# EAGLE design RobotDriver (EAGLE 7.7.0)
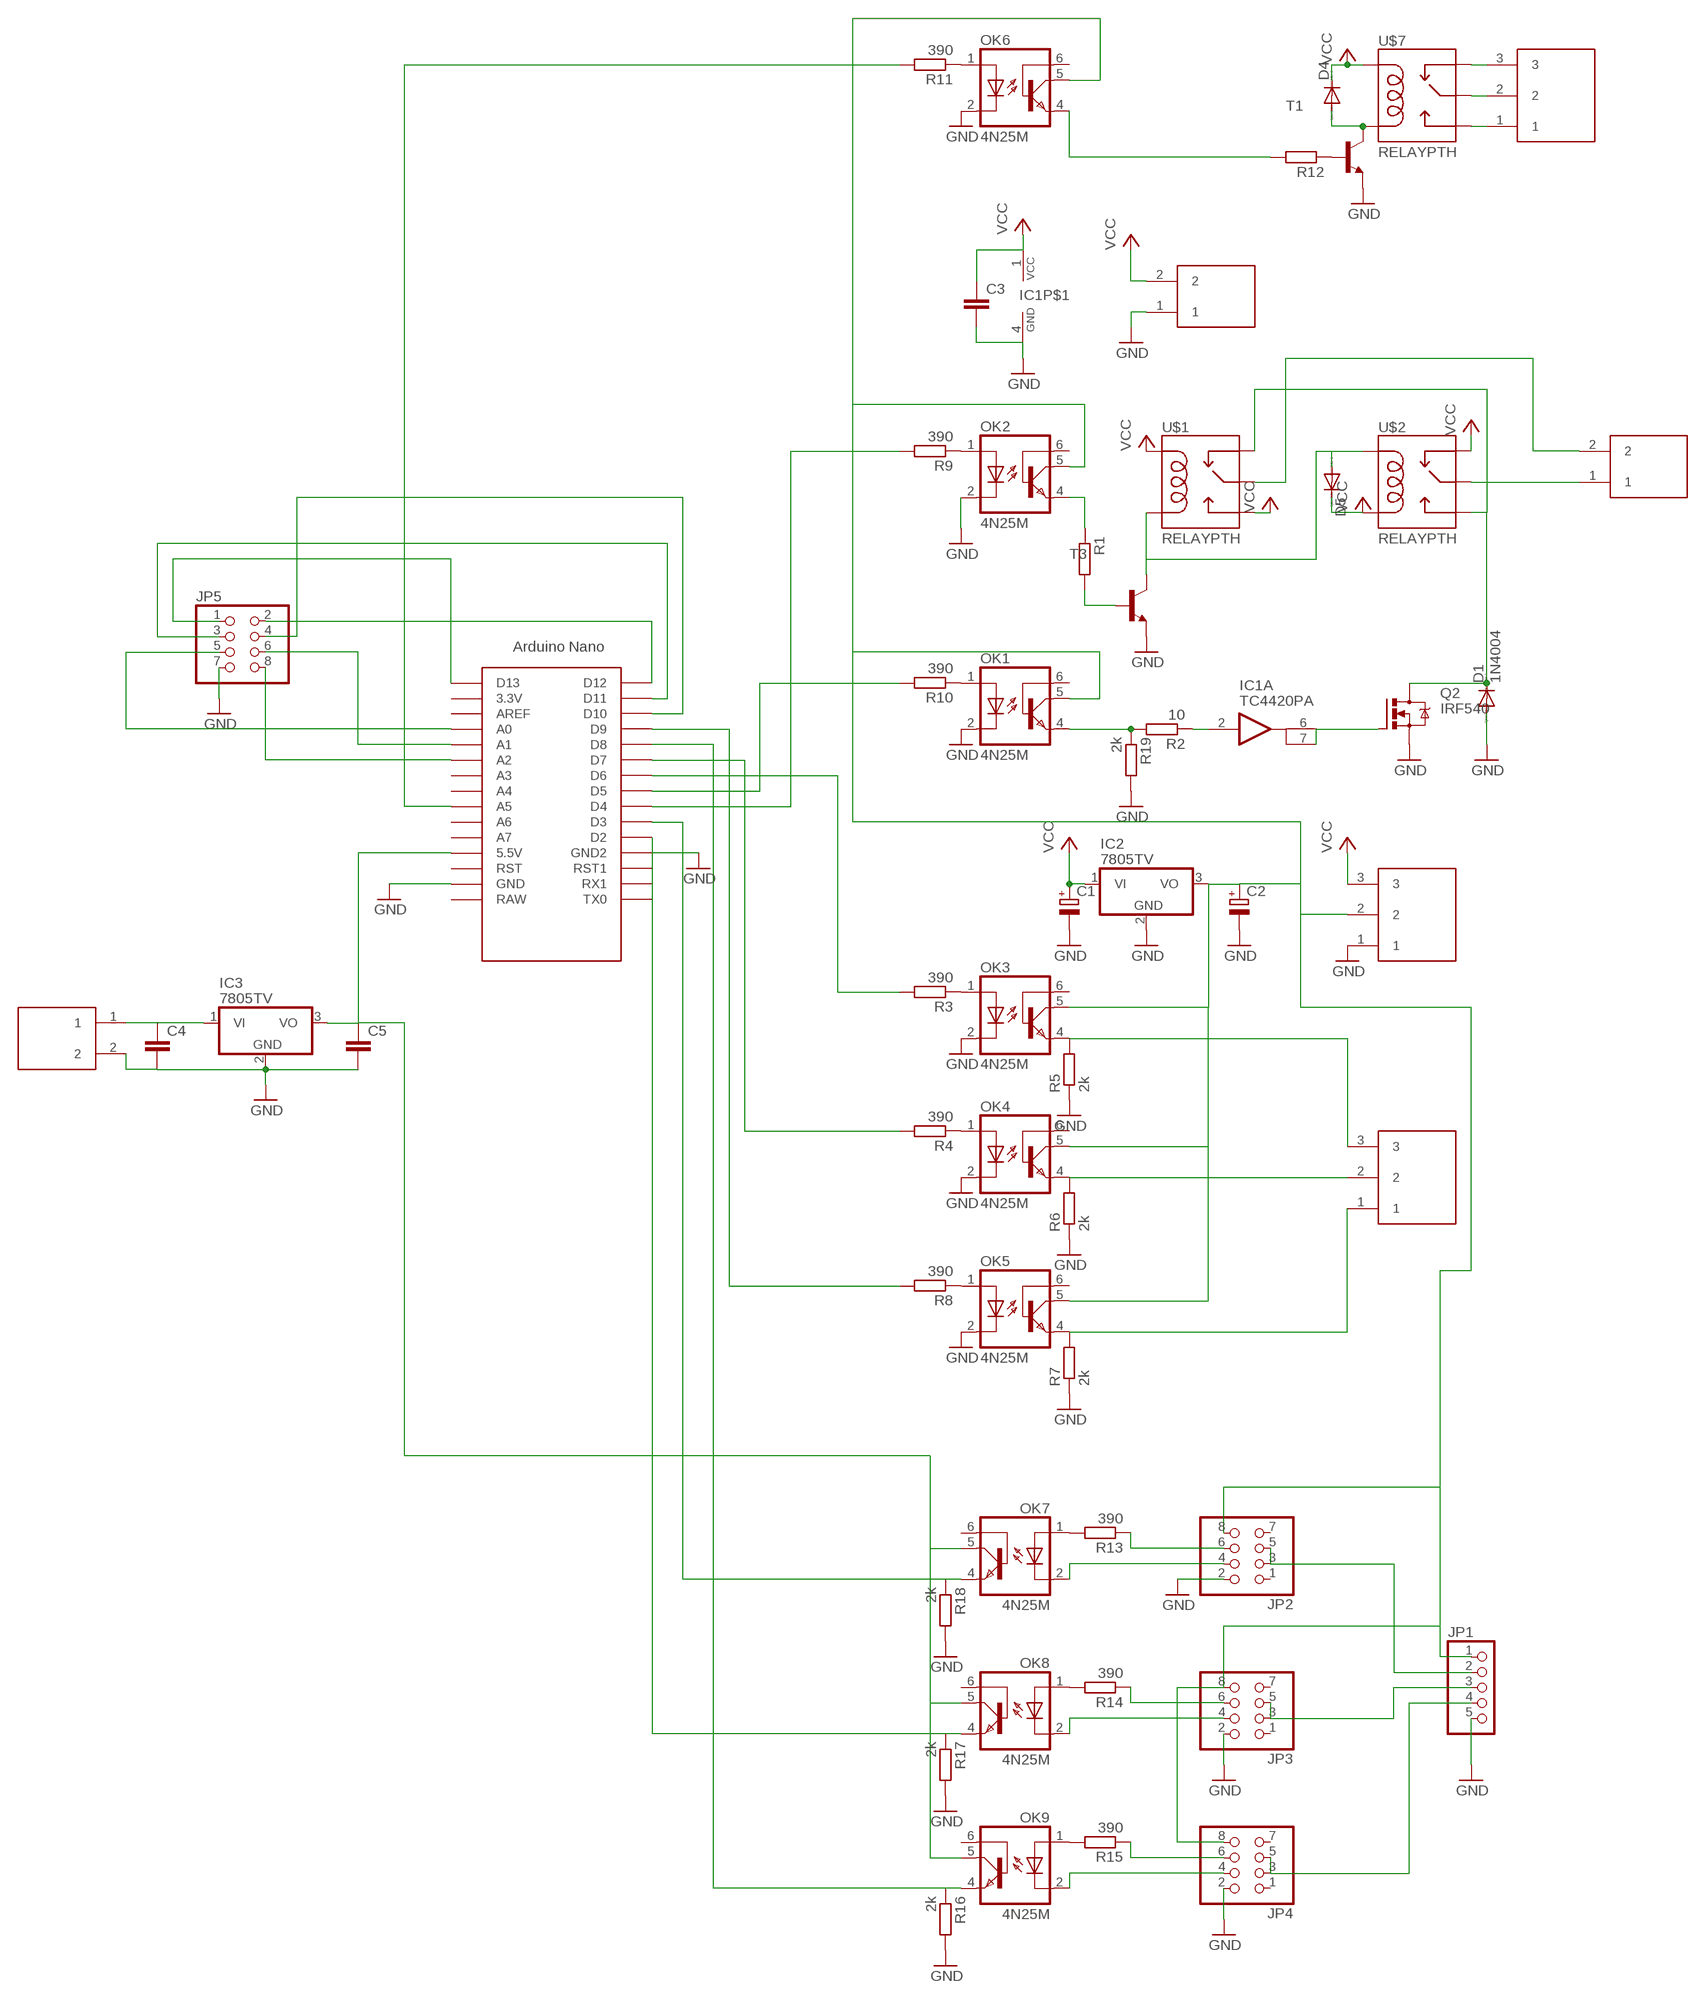
[diagram p0: schematic, sheet 1]

## Parts
C1  CPOL-EUE5-10.5  [E5-10,5]
C2  CPOL-EUE5-10.5  [E5-10,5]
C3  C-EUC1206  [C1206]
C4  C-EUC1206  [C1206]
C5  C-EUC1206  [C1206]
D1  1N4004  [DO41-10]
D4  DIODE-DO214AA  [DO214AA]
D5  DIODE-DO214AA  [DO214AA]
IC1  TC4420PA  [DIP08]
IC2  7805TV  [TO220V]
IC3  7805TV  [TO220V]
JP1  PINHD-1X5  [1X05]
JP2  PINHD-2X4  [2X04]
JP3  PINHD-2X4  [2X04]
JP4  PINHD-2X4  [2X04]
JP5  PINHD-2X4  [2X04]
OK1  4N25M  [DIL06]
OK2  4N25M  [DIL06]
OK3  4N25M  [DIL06]
OK4  4N25M  [DIL06]
OK5  4N25M  [DIL06]
OK6  4N25M  [DIL06]
OK7  4N25M  [DIL06]
OK8  4N25M  [DIL06]
OK9  4N25M  [DIL06]
Q2  IRF540  [TO220BV]
R1  R-EU_R1210  [R1210]
R2  10  R-EU_R1210  [R1210]
R3  390  R-EU_R1210  [R1210]
R4  390  R-EU_R1210  [R1210]
R5  2k  R-EU_R1210  [R1210]
R6  2k  R-EU_R1210  [R1210]
R7  2k  R-EU_R1210  [R1210]
R8  390  R-EU_R1210  [R1210]
R9  390  R-EU_R1210  [R1210]
R10  390  R-EU_R1210  [R1210]
R11  390  R-EU_R1210  [R1210]
R12  R-EU_R1210  [R1210]
R13  390  R-EU_R1210  [R1210]
R14  390  R-EU_R1210  [R1210]
R15  390  R-EU_R1210  [R1210]
R16  2k  R-EU_R1210  [R1210]
R17  2k  R-EU_R1210  [R1210]
R18  2k  R-EU_R1210  [R1210]
R19  2k  R-EU_R1210  [R1210]
T1  BC817-16-NPN-SOT23-BEC  [SOT23-BEC]
T3  BC817-16-NPN-SOT23-BEC  [SOT23-BEC]
U$1  RELAYPTH  [SRD-05VDC-SL-C]
U$2  RELAYPTH  [SRD-05VDC-SL-C]
U$3  NANO  [NANO]
U$4  2EDG-2  [2EGD-2-PAK]
U$5  2EDG-2  [2EGD-2-PAK]
U$6  2EDG-3  [2EGD-3-PAK]
U$7  RELAYPTH  [SRD-05VDC-SL-C]
U$8  2EDG-3  [2EGD-3-PAK]
U$9  2EDG-3  [2EGD-3-PAK]
U$10  2EDG-2  [2EGD-2-PAK]

## Nets
GND: C1.- C2.- C3.2 C4.2 C5.2 D1.A IC1.4(P$1:GND) IC2.2(GND) IC3.2(GND) JP1.5 JP2.2 JP3.2 JP4.2 JP5.7 OK1.2(C) OK2.2(C) OK3.2(C) OK4.2(C) OK5.2(C) OK6.2(C) Q2.S R5.1 R6.1 R7.1 R16.2 R17.2 R18.2 R19.2 T1.E T3.E U$3.GND U$3.GND1(GND2) U$5.1 U$9.1 U$10.2
N$1: R1.2 T3.B
N$2: D5.A T3.C U$1.COIL0 U$2.COIL1
N$3: OK2.4(EMI) R1.1
N$4: D1.C Q2.D U$1.SWCLOSED(SWCLOSE) U$2.SWOPEN
N$5: OK1.4(EMI) R2.2 R19.1
N$6: OK3.1(A) R3.1
N$7: OK2.1(A) R9.1
N$8: OK1.1(A) R10.1
N$9: R9.2 U$3.D4
N$10: U$2.SWCOMMON U$4.1
N$11: U$1.SWCOMMON U$4.2
N$12: IC1.6(A:OUT1) IC1.7(A:OUT2) Q2.G
N$13: C2.+ IC2.3(VO) JP1.1 JP2.8 JP3.8 JP4.8 OK1.5(COL) OK2.5(COL) OK3.5(COL) OK4.5(COL) OK5.5(COL) OK6.5(COL) U$9.2
N$14: OK3.4(EMI) R5.2 U$6.3
N$15: OK4.4(EMI) R6.2 U$6.2
N$16: OK5.4(EMI) R7.2 U$6.1
N$17: OK4.1(A) R4.1
N$18: OK5.1(A) R8.1
N$19: OK6.1(A) R11.1
N$20: D4.A T1.C U$7.COIL0
N$21: R12.1 T1.B
N$22: JP2.4 OK7.2(C)
N$23: OK6.4(EMI) R12.2
N$24: JP3.6 R14.1
N$25: OK7.1(A) R13.2
N$26: OK8.1(A) R14.2
N$27: OK9.1(A) R15.2
N$28: JP3.4 OK8.2(C)
N$29: JP2.6 R13.1
N$30: JP4.6 R15.1
N$31: JP4.4 OK9.2(C)
N$32: IC1.2(A:IN) R2.1
N$33: C5.1 IC3.3(VO) OK7.5(COL) OK8.5(COL) OK9.5(COL) U$3.5V(5.5V)
N$34: JP5.2 U$3.D12
N$35: JP1.2 JP2.3 JP2.5
N$36: JP1.3 JP3.3 JP3.5
N$37: JP1.4 JP4.3 JP4.5
N$38: OK9.4(EMI) R16.1 U$3.D8
N$39: OK8.4(EMI) R17.1 U$3.D2
N$40: OK7.4(EMI) R18.1 U$3.D3
N$41: U$7.SWCLOSED(SWCLOSE) U$8.3
N$42: U$7.SWCOMMON U$8.2
N$43: U$7.SWOPEN U$8.1
N$44: C4.1 IC3.1(VI) U$10.1
N$45: R11.2 U$3.A5
N$46: JP5.1 U$3.D13
N$47: R10.2 U$3.D5
N$48: R3.2 U$3.D6
N$49: R4.2 U$3.D7
N$50: R8.2 U$3.D9
N$51: JP5.3 U$3.D11
N$52: JP5.4 U$3.D10
N$53: JP5.5 U$3.A0
N$54: JP5.6 U$3.A1
N$55: JP5.8 U$3.A2
VCC: C1.+ C3.1 D4.C D5.C IC1.1(P$1:VCC) IC2.1(VI) U$1.COIL1 U$1.SWOPEN U$2.COIL0 U$2.SWCLOSED(SWCLOSE) U$5.2 U$7.COIL1 U$9.3
Unconnected: JP2.1 JP2.7 JP3.1 JP3.7 JP4.1 JP4.7 OK1.6(BAS) OK2.6(BAS) OK3.6(BAS) OK4.6(BAS) OK5.6(BAS) OK6.6(BAS) OK7.6(BAS) OK8.6(BAS) OK9.6(BAS) U$3.3.3V U$3.A3 U$3.A4 U$3.A6 U$3.A7 U$3.AREF U$3.ICSP1 U$3.ICSP2 U$3.ICSP3 U$3.ICSP4 U$3.ICSP5 U$3.ICSP6 U$3.RAW U$3.RST U$3.RST1 U$3.RX1 U$3.TX0

## Power pins joined to a net without a drawn wire
GND: IC1.5(P$2:GND)
VCC: IC1.8(P$2:VCC)

## Library data of the parts
C1 C2 = rcl:CPOL-EU: POLARIZED CAPACITOR, European symbol
C3-C5 = rcl:C-EU: CAPACITOR, European symbol
D1 = diode:1N4004: DIODE general purpose rectifier, 1 A
D4 D5 = diode:DIODE-: DIODE
IC1 = newchips:TC4420: Microchip 6A High-Speed MOSFET Drivers
IC2 IC3 = linear:78*: Positive VOLTAGE REGULATOR Source: http://cache.national.com/ds/LM/LM78L05.pdf http://www.fairchildsemi.com/ds/LM/LM7805.pdf
JP1 = pinhead:PINHD-1X5: PIN HEADER
JP2-JP5 = pinhead:PINHD-2X4: PIN HEADER
OK1-OK9 = optocoupler:4N*?M: General Purpose 6-Pin Phototransistor Optocouplers Source: http://www.fairchildsemi.com/ds/4N/4N35-M.pdf; MPN: 4N25-M; OC_FARNELL: 1021349; OC_NEWARK: 98K9084
Q2 = transistor-power:IRF540: HEXFET Power MOSFET
R1-R19 = rcl:R-EU_: RESISTOR, European symbol
T1 T3 = transistor:*-NPN-: NPN Transistror BF959 corrected 2008.03.06
U$1 U$2 U$7 = SRD-05VDC-SL-C:RELAY: SPDT relay (COM-00101)
U$3 = Arduino-clone:NANO: Arduino Nano
U$4 U$5 U$10 = tommilib:2EDG-2
U$6 U$8 U$9 = tommilib:2EDG-3

## Board
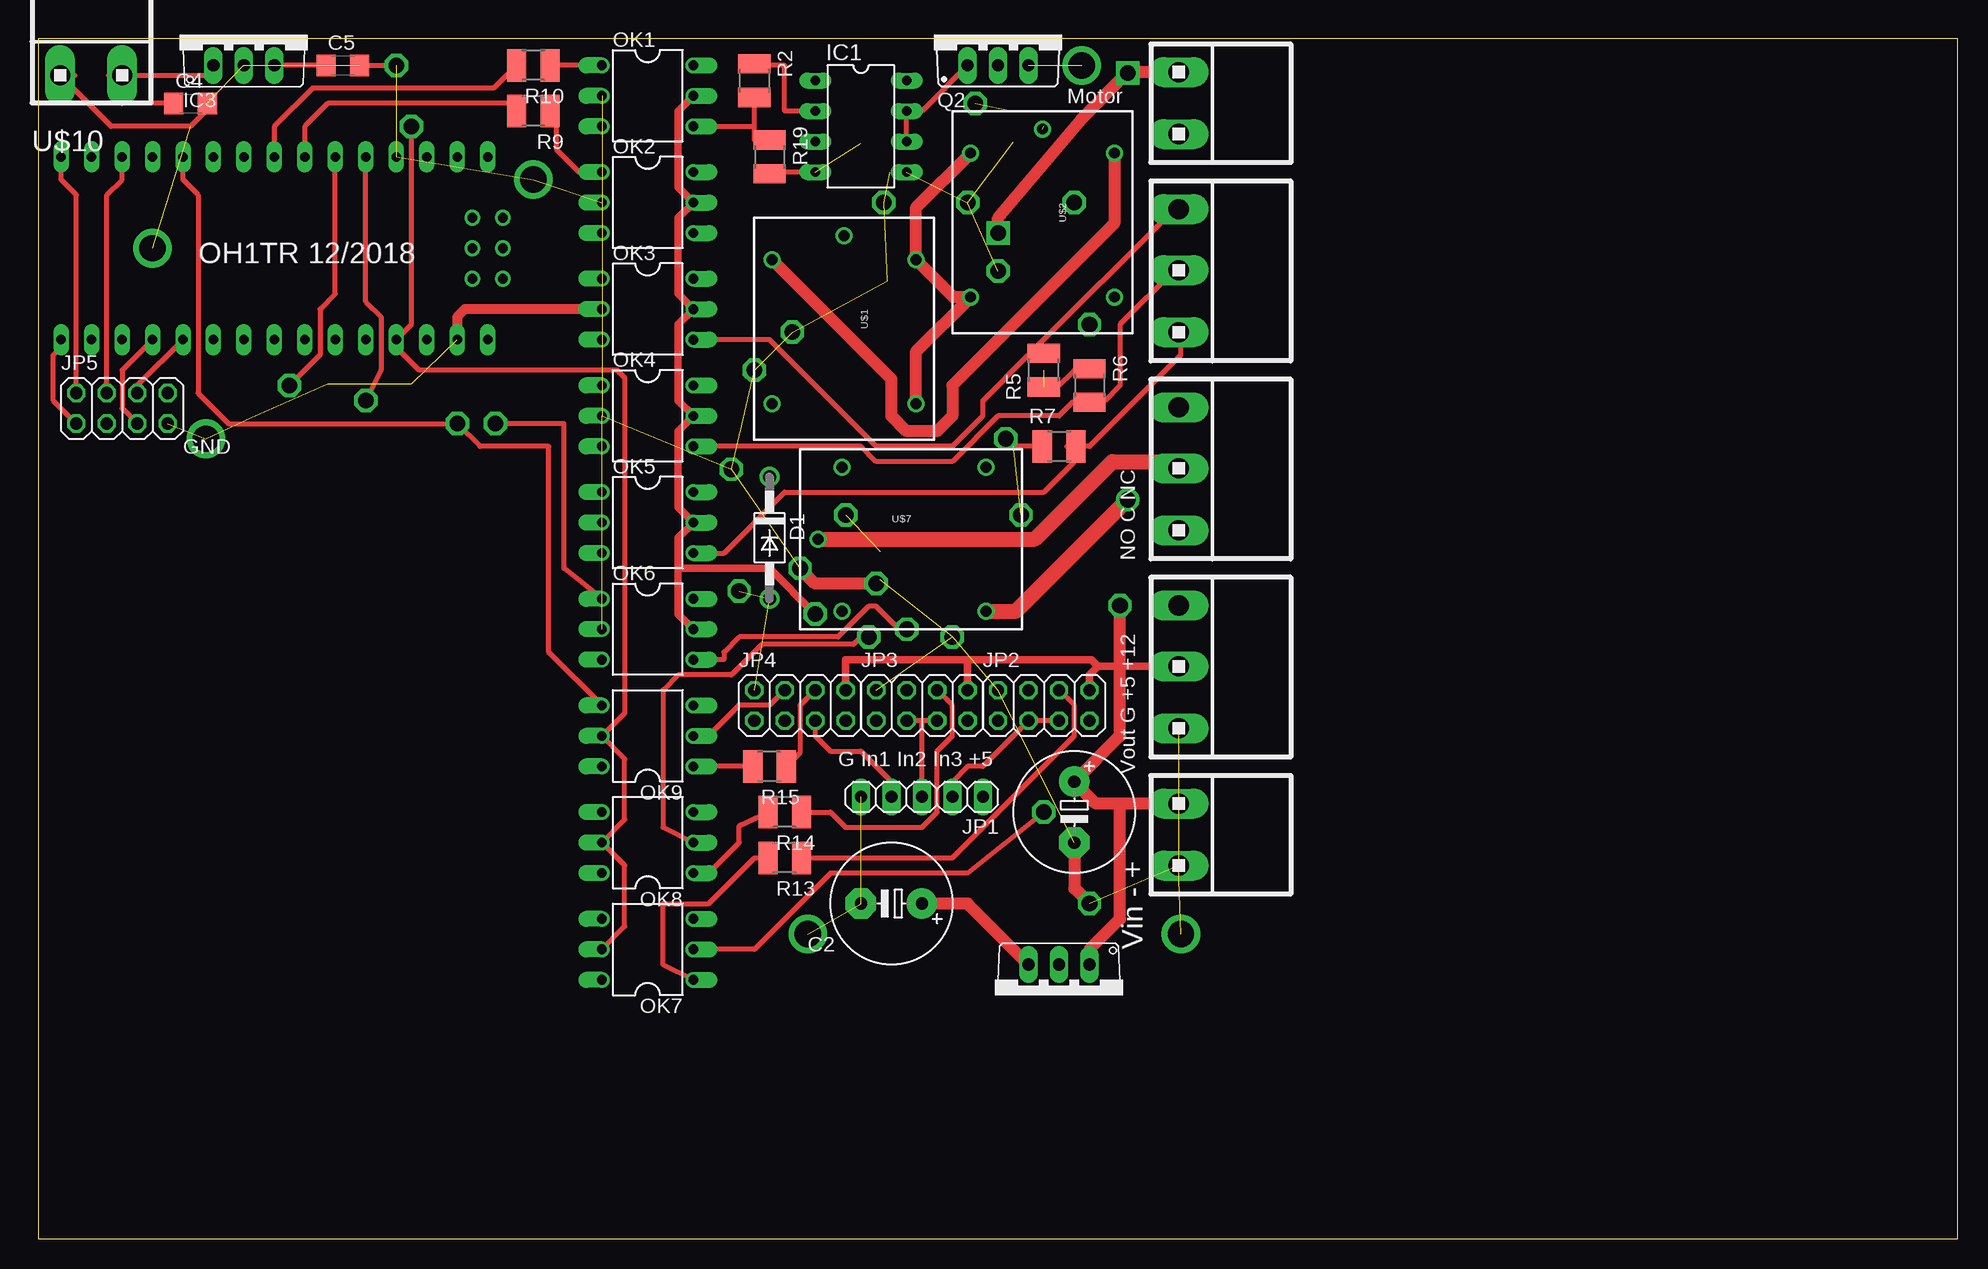
[diagram p1: board, top side]
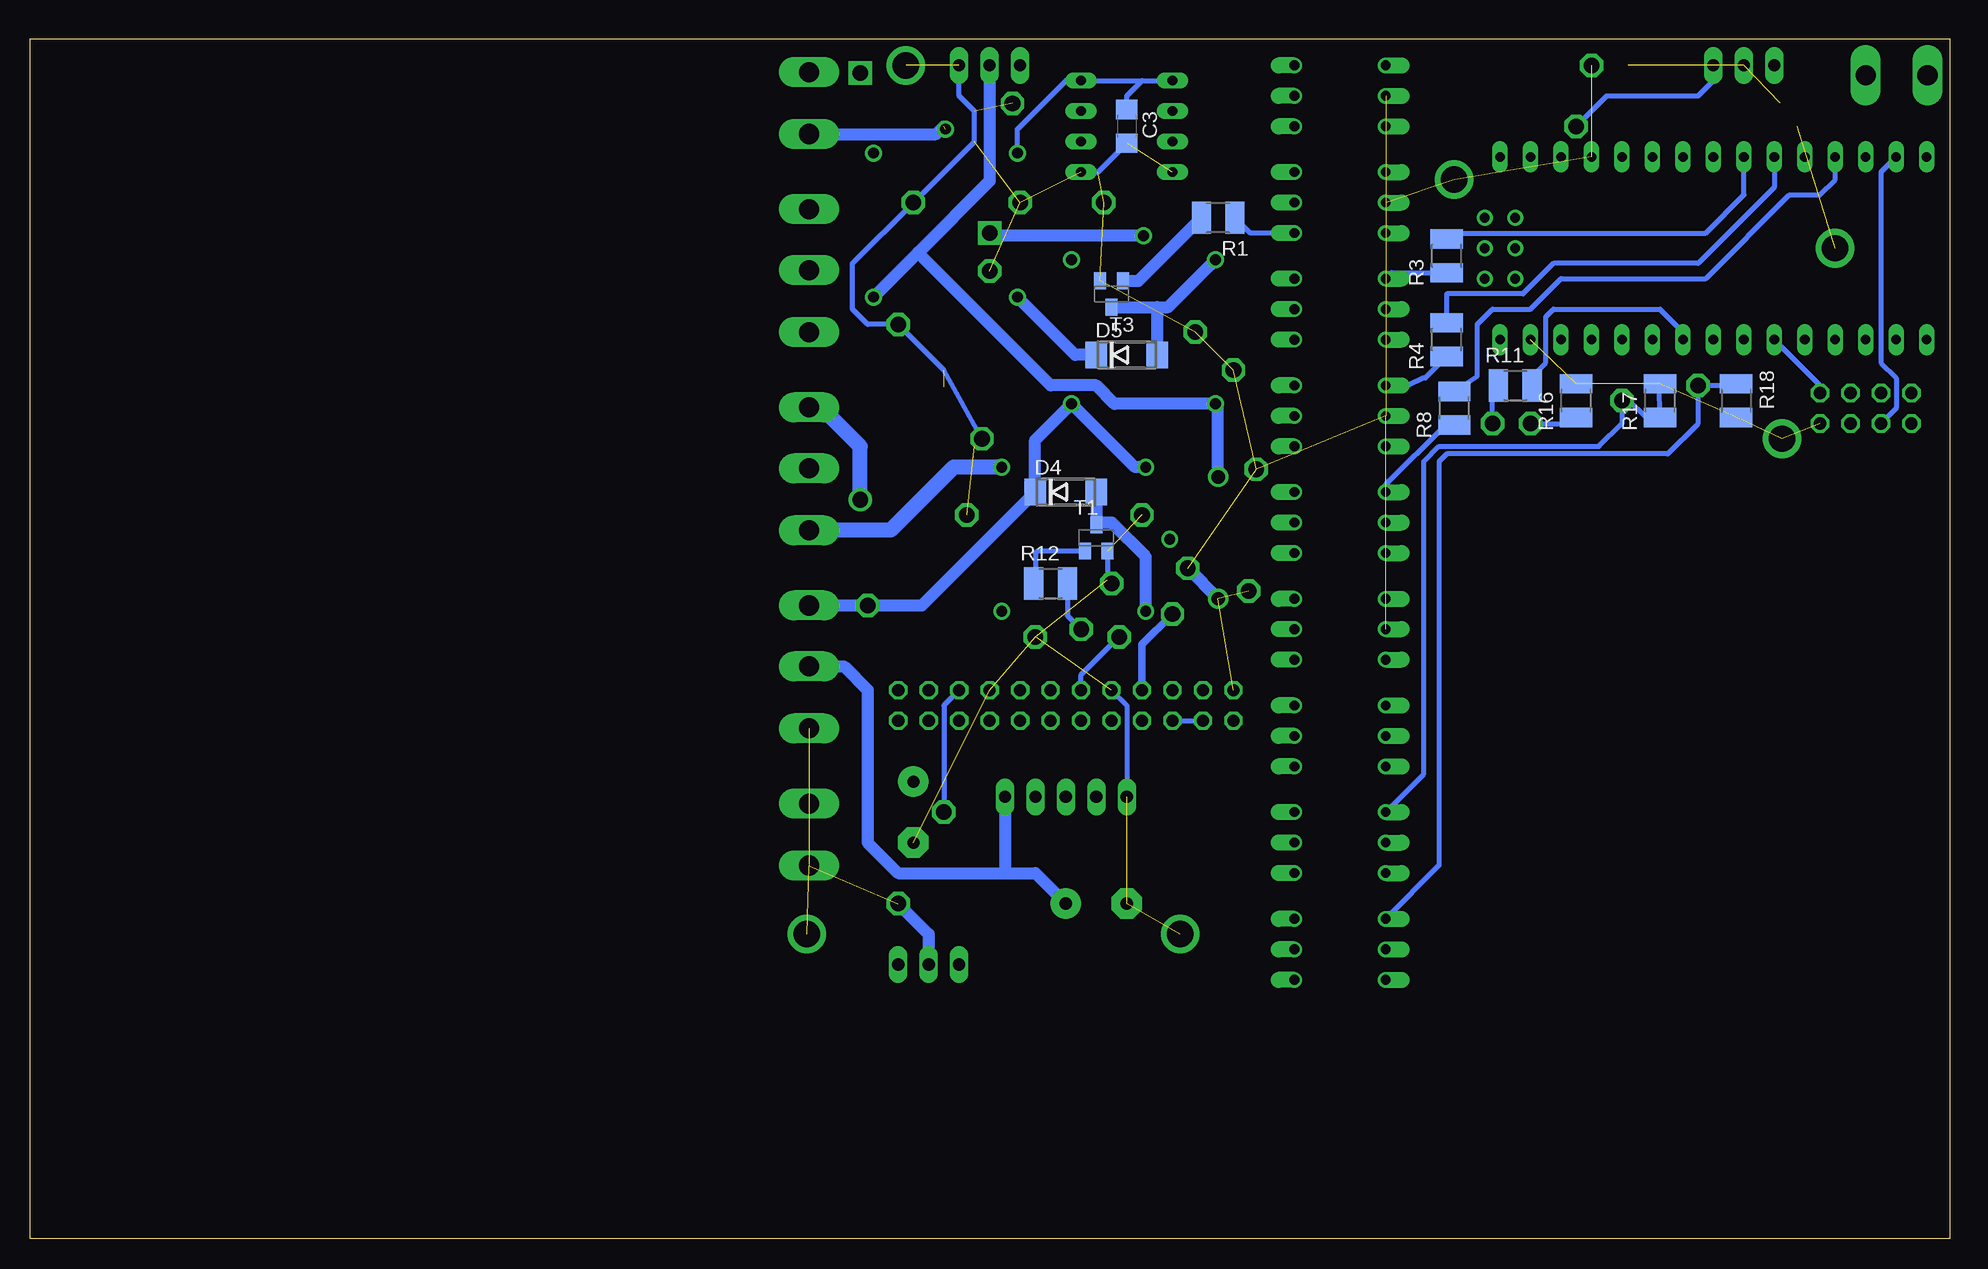
[diagram p2: board, bottom side, seen from below]

Size 160 x 100 mm. Coordinates in mm from the lower left corner, seen from the top.
Outline: 0,0 160,0 160,100 0,100 0,0
Copper layers (1*16): Top 0.035mm / dielectric 1.5mm / Bottom 0.035mm
Design rules "ITEADstudio_DRC": minimum track width 6mil, minimum drill 12mil, track to track 6mil, track to pad 6mil, pad to pad 6mil, via to via 6mil, smd to smd 0mil, copper to edge 10mil, drill to drill 10mil, minimum pad ring 10mil, minimum via ring 6mil, stop-mask expansion 2mil, vias tented up to drill 100mil, thermal gap 10mil

### Footprints (pad centres in the part's own frame; a part is rotated, then mirrored left to right if it is on the bottom)
E5-10,5 = drill 1.016 pad 2.54: + -2.54,0 | drill 1.016 pad 2.54 octagon: - 2.54,0
C1206 = smd 1.6 x 1.8: 1 -1.4,0; 2 1.4,0
DO41-10 = drill 1.118: A 5.08,0; C -5.08,0
DO214AA = smd 1.8 x 2.2: A 2.55,0; C -2.55,0
DIP08 = drill 0.813 long: 1 -3.81,-3.81; 2 -1.27,-3.81; 3 1.27,-3.81; 4 3.81,-3.81; 5 3.81,3.81; 6 1.27,3.81; 7 -1.27,3.81; 8 -3.81,3.81
TO220V = drill 1.016 long: 1 -2.54,-2.54; 2 0,-2.54; 3 2.54,-2.54
1X05 = drill 1.016 long: 1 -5.08,0; 2 -2.54,0; 3 0,0; 4 2.54,0; 5 5.08,0
2X04 = drill 1.016 octagon: 1 -3.81,-1.27; 2 -3.81,1.27; 3 -1.27,-1.27; 4 -1.27,1.27; 5 1.27,-1.27; 6 1.27,1.27; 7 3.81,-1.27; 8 3.81,1.27
DIL06 = drill 0.813 offset: 1 -2.54,-3.81; 2 0,-3.81; 3 2.54,-3.81; 4 2.54,3.81; 5 0,3.81; 6 -2.54,3.81
TO220BV = drill 1.016 long: D 0,-2.54; G -2.54,-2.54; S 2.54,-2.54
R1210 = smd 1.6 x 2.7: 1 -1.4,0; 2 1.4,0
SOT23-BEC = smd 1 x 1.4: B -0.95,-1.1; C 0,1.1; E 0.95,-1.1
SRD-05VDC-SL-C = drill 0.9: COIL0 -5.39,-6.12; COIL1 -5.39,5.88; SWCLOSED 6.61,-6.12; SWCOMMON -7.39,-0.12; SWOPEN 6.61,5.88
NANO = drill 0.8 long: 3.3V -10.16,24.13; 5V -10.16,-1.27; A0 -10.16,19.05; A1 -10.16,16.51; A2 -10.16,13.97; A3 -10.16,11.43; A4 -10.16,8.89; A5 -10.16,6.35; A6 -10.16,3.81; A7 -10.16,1.27; AREF -10.16,21.59; D2 5.08,1.27; D3 5.08,3.81; D4 5.08,6.35; D5 5.08,8.89; D6 5.08,11.43; D7 5.08,13.97; D8 5.08,16.51; D9 5.08,19.05; D10 5.08,21.59; D11 5.08,24.13; D12 5.08,26.67; D13 -10.16,26.67; GND -10.16,-6.35; GND1 5.08,-1.27; RAW -10.16,-8.89; RST -10.16,-3.81; RST1 5.08,-3.81; RX1 5.08,-6.35; TX0 5.08,-8.89 | drill 0.8: ICSP1 -5.08,-10.16; ICSP2 -5.08,-7.62; ICSP3 -2.54,-10.16; ICSP4 -2.54,-7.62; ICSP5 0,-10.16; ICSP6 0,-7.62
2EGD-2-PAK = drill 1.676 long: 1 3.181,-4; 2 -1.981,-4
2EGD-3-PAK = drill 1.676 long: 1 5.721,-5.27; 2 0.559,-5.27; 3 -4.521,-5.27

### Placement (x,y rotation side)
C1  86.36,35.56 270 top
C2  71.12,27.94 180 top
C3  68.58,92.71 270 bottom
C4  12.7,94.61 0 top
C5  25.4,97.79 0 top
D1  60.96,58.42 270 top
D4  73.66,62.23 0 bottom
D5  68.58,73.66 0 bottom
IC1  68.58,92.71 270 top
IC2  85.09,20.32 180 top
IC3  17.14,100.33 0 top
JP1  73.66,36.83 180 top
JP2  83.82,44.45 0 top
JP3  73.66,44.45 0 top
JP4  63.5,44.45 0 top
JP5  6.99,69.22 0 top
OK1  50.8,95.25 270 top
OK2  50.8,86.36 270 top
OK3  50.8,77.47 270 top
OK4  50.8,68.58 270 top
OK5  50.8,59.69 270 top
OK6  50.8,50.8 270 top
OK7  50.8,24.13 90 top
OK8  50.8,33.02 90 top
OK9  50.8,41.91 90 top
Q2  80.01,100.33 0 top
R1  60.96,85.09 180 bottom
R2  59.69,96.52 270 top
R3  41.91,81.92 90 bottom
R4  41.91,74.93 90 bottom
R5  83.82,72.39 90 top
R6  87.63,71.12 270 top
R7  85.09,66.04 0 top
R8  41.27,69.22 90 bottom
R9  41.27,93.98 180 top
R10  41.27,97.79 180 top
R11  36.2,71.12 0 bottom
R12  74.93,54.61 0 bottom
R13  62.23,31.75 180 top
R14  62.23,35.56 180 top
R15  60.96,39.37 180 top
R16  31.11,69.85 90 bottom
R17  24.13,69.85 90 bottom
R18  17.78,69.85 270 bottom
R19  60.96,90.17 270 top
T1  71.12,58.42 0 bottom
T3  69.85,78.74 180 bottom
U$1  67.3,76.2 270 top
U$2  83.82,85.09 270 top
U$3  28.57,85.09 90 top
U$4  99.06,95.25 270 top
U$5  99.06,34.29 270 top
U$6  100.33,81.28 270 top
U$7  72.39,58.42 0 top
U$8  100.33,64.77 270 top
U$9  100.33,48.26 270 top
U$10  3.81,100.97 0 top

### Tracks (layer width: path | path; a pad name or v marks a point on that pad's centre or on a via)
GND  (via drill 1.3, 2.2)  (43 unrouted)
  Top 0.406: R5.1 84.96,70.99 86.36,72.39 87.5,72.39 R6.1 | IC1.4 61.09,88.9 R19.2 | 3.04,96.97 U$10.2 6.08,92.71 12.7,92.71 14.1,94.11 C4.2 | C5.2 v29.84,97.79 | R7.1 81.28,66.04 v80.64,66.67
  Top 0.813: OK3.2 35.56,77.47 34.92,76.83 U$3.GND
  Top 1.016: v69.85,54.61 64.77,54.61 v63.5,55.88 | C1.- 86.36,29.21 v87.63,27.94
  Bottom 0.406: IC1.5 70.99,88.9 C3.2 | Q2.S 82.55,95.25 81.28,93.98 81.28,91.44 v86.36,86.36 91.44,81.28 91.44,77.47 90.17,76.2 v87.63,76.2 83.82,72.39 v80.64,66.67 | T1.E 70.17,54.93 v69.85,54.61 | JP3.2 68.58,44.45 JP1.5
  Bottom 1.016: v63.5,55.88 D1.A | v87.63,27.94 85.09,25.4 IC2.2
  other vias: 62.87,75.56 59.69,72.39 57.78,64.14 58.42,53.98 77.47,86.36 70.48,86.36 76.2,50.16 80.01,80.64 78.11,94.61 67.31,60.33 81.92,60.33 95.25,25.4 87,97.79 64.14,25.4 41.27,88.27 9.53,82.55 13.97,66.67
N$1
  Bottom 1.016: T3.B 67.61,79.84 R1.2
N$2
  Top 1.016: U$2.COIL1 89.7,84.62 76.2,71.12 76.2,68.58 74.93,67.31 72.39,67.31 71.12,68.58 71.12,71.65 U$1.COIL0
  Bottom 1.016: 61.66,81.11 U$1.COIL0 65.13,77.64 66.04,77.64 | T3.C 66.04,77.64 | D5.A 66.03,77.63 66.04,77.64
N$3
  Bottom 0.406: OK2.4 58.29,83.82 R1.1
N$4
  Bottom 1.016: Q2.D 80.01,88.17 86,82.19 | 86,82.19 U$2.SWOPEN | 86,82.19 74.93,71.12 71.12,71.12 69.59,69.59 U$1.SWCLOSED 60.96,69.59 D1.C
N$5
  Top 0.406: R19.1 59.69,91.57 59.69,92.71 | 59.69,92.71 R2.2 | OK1.4 59.69,92.71
N$6
  Bottom 0.406: OK3.1 46.48,80.52 R3.1
N$7
  Top 0.406: R9.1 43.18,93.47 43.18,90.81 45.09,88.9 OK2.1
N$8
  Top 0.406: OK1.1 R10.1
N$9
  Top 0.406: U$3.D4 22.23,92.71 24.13,94.61 39.24,94.61 R9.2
N$10  (1 unrouted)
  Bottom 1.016: U$4.1 84.46,92.07 83.82,92.71
N$11  (via drill 1.3)
  Top 1.016: v80.01,83.82 80.01,85.09 87,93.34 v90.81,97.16 90.88,97.23 U$4.2
  Bottom 1.016: U$1.SWCOMMON 79.78,83.59 v80.01,83.82
N$12
  Top 0.406: IC1.6 IC1.7 73.66,93.98 Q2.G
N$13  (via drill 1.3)
  Top 0.61: U$9.2 88.34,47.7 | 88.34,47.7 87.63,46.99 JP2.8 | JP4.8 67.31,48.26 77.47,48.26 | 77.47,48.26 87.78,48.26 88.34,47.7 | JP3.8 77.47,48.26 | 53.34,55.88 53.34,58.42 OK5.5 53.34,60.96 53.34,67.31 OK4.5 53.34,69.85 53.34,76.2 OK3.5 53.34,78.74 53.34,85.09 OK2.5 53.34,87.63 53.34,93.98 OK1.5 | 53.34,55.88 60.96,55.88 v64.77,52.07 | OK6.5 53.34,52.07 53.34,55.88
  Top 1.016: IC2.3 77.47,27.94 C2.+
  Bottom 0.61: v64.77,52.07 67.31,49.53 JP4.8
  Bottom 1.016: U$9.2 92.15,47.7 90.17,45.72 90.17,33.02 87.63,30.48 78.74,30.48 | 78.74,30.48 76.2,30.48 C2.+ | JP1.1 78.74,30.48
N$14
  Top 0.406: U$6.3 94.69,85.8 82.55,73.66 | OK3.4 60.96,74.93 69.85,66.04 76.2,66.04 78.74,68.58 78.74,69.85 82.55,73.66 | 82.55,73.66 83.69,73.66 R5.2
N$15
  Top 0.406: U$6.2 94.69,80.72 90.17,76.2 90.17,71.12 88.9,69.85 87.76,69.85 R6.2 86.23,69.72 85.09,68.58 80.01,68.58 76.2,64.77 69.85,64.77 68.58,66.04 OK4.4
N$16
  Top 0.406: U$6.1 95.06,74.93 | 95.06,74.93 95.06,74.74 | OK5.4 57.15,57.15 62.23,62.23 83.82,62.23 86.36,64.77 86.36,65.91 R7.2 | 95.06,74.93 95.25,74.74 95.25,73.66 87.63,66.04 R7.2 | 85.72,66.04 R7.2
N$17
  Bottom 0.406: OK4.1 45.09,71.12 43.81,71.75 43.69,71.75 R4.1
N$18
  Bottom 0.406: 46.86,62.23 OK5.1 46.99,62.87 42.04,67.81 R8.1
N$19  (via drill 1.3)
  Top 0.406: OK6.1 43.81,55.88 43.81,67.94 v38.1,67.94
  Bottom 0.406: v38.1,67.94 38.1,70.61 R11.1
N$20
  Bottom 1.016: D4.A T1.C 70.95,59.69 69.85,59.69 67,56.84 U$7.COIL0
N$21
  Bottom 0.406: T1.B 76.03,57.32 76.2,57.15 76.2,54.74 R12.1
N$22  (via drill 1.3)
  Top 0.406: v83.82,35.56 77.47,30.48 66.04,30.48 59.69,24.13 OK7.2
  Bottom 0.406: JP2.4 83.82,44.45 v83.82,35.56
N$23  (via drill 1.3)
  Top 0.406: OK6.4 57.15,48.26 57.15,48.9 58.42,50.16 66.67,50.16 69.22,52.7 69.85,52.7 71.75,50.8 v72.39,50.8
  Bottom 0.406: R12.2 73.53,51.94 v72.39,50.8
N$24
  Top 0.406: R14.1 66.04,35.56 67.31,34.29 73.66,34.29 74.93,35.56 74.93,40.64 76.2,41.91 76.2,44.45 JP3.6
N$25
  Top 0.406: OK7.1 52.07,22.86 52.07,27.94 55.88,27.94 59.69,31.75 R13.2
N$26
  Top 0.406: OK8.1 55.88,30.48 58.42,33.02 58.42,34.42 R14.2
N$27
  Top 0.406: R15.2 OK9.1
N$28  (via drill 1.3)
  Top 0.406: OK8.2 52.07,34.29 52.07,45.72 53.34,46.99 57.78,46.99 60.33,49.53 67.94,49.53 68.58,50.16 v69.22,50.16
  Bottom 0.406: JP3.4 72.39,46.99 v69.22,50.16
N$29
  Top 0.406: R13.1 76.2,31.75 86.36,41.91 86.36,44.45 JP2.6
N$30
  Top 0.406: JP4.6 63.5,44.45 63.5,40.51 R15.1
N$31
  Top 0.406: JP4.4 60.96,44.45 58.42,44.45 55.88,41.91 OK9.2
N$32
  Top 0.406: 59.69,97.79 58.55,97.79 R2.1 59.69,97.79 | IC1.2 62.23,93.98 62.23,97.79 59.69,97.79
N$33  (via drill 1.3)
  Top 0.406: C5.1 IC3.3 | OK7.5 48.9,26.04 48.9,31.11 OK8.5 48.9,34.92 48.9,40.01 OK9.5 | 46.35,41.91 OK9.5 | OK9.5 48.9,43.81 48.9,71.75 48.26,72.39 31.75,72.39 29.84,74.3 U$3.5V 31.11,76.2 v31.11,92.71
  Bottom 0.406: v31.11,92.71 28.57,95.25 20.95,95.25 19.68,96.52 IC3.3
N$34
  Top 0.406: JP5.2 3.17,87 1.91,88.27 U$3.D12
N$35
  Top 0.406: JP2.5 JP2.3 78.74,39.37 77.47,39.37 76.2,38.1 JP1.2
N$36
  Top 0.406: JP3.5 73.66,43.18 | 73.66,43.18 JP3.3 | JP1.3 73.66,43.18
N$37
  Top 0.406: JP4.5 64.77,41.91 66.04,40.64 68.58,40.64 71.12,38.1 JP1.4
  Bottom 0.406: JP4.5 JP4.3
N$38  (via drill 1.3)
  Top 0.406: OK9.4 42.55,48.9 42.55,66.04 36.83,66.04 v34.92,67.94 15.88,67.94 13.34,70.48 13.34,87 12.06,88.27 U$3.D8
  Bottom 0.406: 31.11,67.94 R16.1 31.62,67.94 v34.92,67.94
N$39  (via drill 1.3)
  Top 0.406: U$3.D2 27.3,78.11 28.57,76.83 28.57,72.39 v27.3,69.85
  Bottom 0.406: OK8.4 43.81,38.73 43.81,64.77 42.55,66.04 29.21,66.04 27.3,67.94 v27.3,69.85 26.67,69.85 25.4,68.58 24.26,68.58 R17.1 24.26,71.12
N$40  (via drill 1.3)
  Top 0.406: U$3.D3 24.77,78.74 23.5,77.47 23.5,73.66 v20.95,71.12
  Bottom 0.406: OK7.4 42.55,31.11 42.55,64.77 41.91,65.41 23.5,65.41 20.95,67.94 v20.95,71.12 17.27,71.12 R18.1
N$41  (via drill 1.3)
  Top 1.27: U$7.SWCLOSED 81.51,52.3 v90.81,61.59
  Bottom 1.27: v90.81,61.59 90.81,66.04 93.98,69.22 94.98,69.22 U$8.3
N$42
  Top 1.016: 93.98,64.77 94.5,64.77
  Top 1.27: U$7.SWCOMMON 83.06,58.3 89.53,64.77 94.5,64.77 U$8.2
N$43
  Bottom 1.27: U$7.SWOPEN 83.02,64.3 88.27,59.05 U$8.1
N$44
  Top 0.406: U$10.1 14.61,96.97 IC3.1 | U$10.1 5.84,96.97 | C4.1 6.99,94.61 U$10.1
N$45
  Bottom 0.406: R11.2 35.43,71.25 33.66,73.03 33.66,76.83 33.02,77.47 24.13,77.47 22.23,75.56 U$3.A5
N$46
  Top 0.406: JP5.1 1.27,69.85 1.27,73.66 1.91,74.3 U$3.D13
N$47
  Top 0.406: R10.2 37.97,95.89 22.86,95.89 19.68,92.71 U$3.D5
N$48
  Bottom 0.406: R3.2 41.41,83.82 20.32,83.82 17.14,87 U$3.D6
N$49
  Bottom 0.406: U$3.D7 14.61,87.63 20.95,81.28 33.02,81.28 35.56,78.74 41.91,78.74 R4.2
N$50
  Bottom 0.406: R8.2 39.37,71.89 39.37,76.2 38.1,77.47 34.92,77.47 32.38,80.01 20.32,80.01 13.34,87 10.79,87 9.53,88.27 U$3.D9
N$51
  Bottom 0.406: U$3.D11 5.71,88.9 5.71,73.03 4.45,71.75 4.45,69.22 JP5.3
N$52
  Top 0.406: JP5.4 5.71,87 6.99,88.27 U$3.D10
N$53
  Top 0.406: U$3.A0 6.99,72.39 6.99,69.22 JP5.5
N$54
  Top 0.406: U$3.A1 8.26,71.12 JP5.6
N$55
  Bottom 0.406: U$3.A2 10.79,71.12 JP5.8
VCC  (via drill 1.3)
  Top 1.016: U$1.SWOPEN 73.18,73.96 U$2.SWCLOSED 76.29,78.48 U$1.COIL1 73.18,85.96 U$2.COIL0 | U$5.2 90.17,36.27 | 90.17,36.27 88.19,36.27 C1.+ 90.17,41.91 v90.17,52.78 | IC2.1 87.63,24.13 90.17,26.67 90.17,36.27
  Bottom 0.406: C3.1 68.58,95.25 67.31,96.52 IC1.1 IC1.8 73.66,96.52 77.7,92.48 U$2.COIL0
  Bottom 1.016: U$7.COIL1 67.89,64.3 U$1.SWOPEN 76.21,66.56 D4.C 85.66,52.78 v90.17,52.78 U$9.3 | D5.C 72.88,73.66 U$2.SWCLOSED

### Text on the board
tNames: Motor | OH1TR 12/2018 | GND | NO C NC | G In1 In2 In3 +5 | Vout G +5 +12 | Vin - +